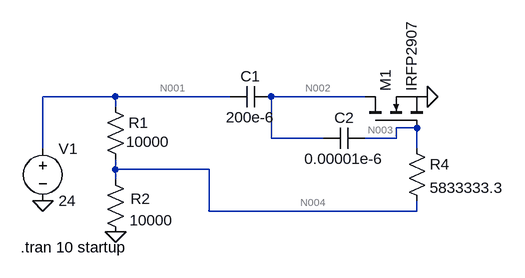
[diagram p0: schematic InRush Current Control Circuit.asc]
InRush Current Control Circuit.asc, the LTspice schematic file:
Version 4
SHEET 1 880 680
WIRE -64 32 -176 32
WIRE 112 32 -64 32
WIRE 320 32 176 32
WIRE -64 48 -64 32
WIRE 400 80 368 80
WIRE 176 96 176 32
WIRE 256 96 176 96
WIRE 368 96 368 80
WIRE 368 96 320 96
WIRE -176 112 -176 32
WIRE 400 112 400 80
WIRE -64 144 -64 128
WIRE 80 144 -64 144
WIRE -64 160 -64 144
WIRE 80 208 80 144
WIRE 400 208 400 192
WIRE 400 208 80 208
FLAG -176 192 0
FLAG 416 32 0
FLAG -64 240 0
SYMBOL voltage -176 96 R0
WINDOW 123 0 0 Left 0
WINDOW 39 0 0 Left 0
SYMATTR InstName V1
SYMATTR Value 24
SYMBOL nmos 320 80 R270
SYMATTR InstName M1
SYMATTR Value IRFP2907
SYMBOL res -80 32 R0
WINDOW 3 32 69 Left 2
SYMATTR InstName R1
SYMATTR Value 10000
SYMBOL res -48 256 R180
WINDOW 0 -38 67 Left 2
WINDOW 3 -73 34 Left 2
SYMATTR InstName R2
SYMATTR Value 10000
SYMBOL cap 176 16 R90
WINDOW 0 0 32 VBottom 2
WINDOW 3 32 32 VTop 2
SYMATTR InstName C1
SYMATTR Value 200e-6
SYMATTR SpiceLine Rser=1
SYMBOL cap 256 112 R270
WINDOW 0 32 32 VTop 2
WINDOW 3 0 32 VBottom 2
SYMATTR InstName C2
SYMATTR Value 0.00001e-6
SYMATTR SpiceLine Rser=1000
SYMBOL res 384 96 R0
SYMATTR InstName R4
SYMATTR Value 5833333.3
TEXT -210 264 Left 2 !.tran 10 startup

The netlist it stands for:
* InRush Current Control Circuit.asc
V1 N001 0 24
M1 N002 N003 0 0 IRFP2907
R1 N001 N004 10000
R2 0 N004 10000
C1 N002 N001 200e-6 Rser=1
C2 N002 N003 0.00001e-6 Rser=1000
R4 N003 N004 5833333.3
.model NMOS NMOS
.model PMOS PMOS
.lib standard.mos
.tran 10 startup
.backanno
.end

* Results of the author's LTspice run, read from the files saved beside the schematic
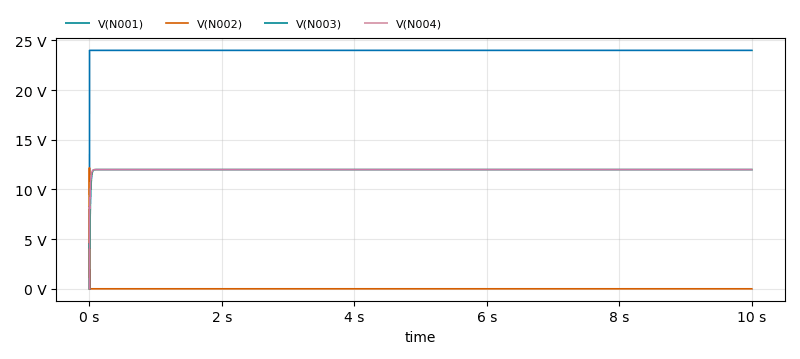
[diagram p1: Transient Analysis of InRush Current Control Circuit.asc, plotted from the saved traces]
* Transient Analysis, 1 run:
*   V(N001): min 0 V, max 24 V, average 24 V, rms 24 V, last 24 V
*   V(N002): min 0 V, max 12.17 V, average 795.9 µV, rms 44.78 mV, last 0 V
*   V(N003): min 0 V, max 12 V, average 11.99 V, rms 11.99 V, last 12 V
*   V(N004): min 0 V, max 12 V, average 11.99 V, rms 11.99 V, last 12 V